# Altium schematic sheet TOP.SchDoc
size A3; DrawnBy: Lorna Lan, Dylan Vogel; DocumentNumber: 1; Revision: v4.3; SheetNumber: 1; SheetTotal: 20
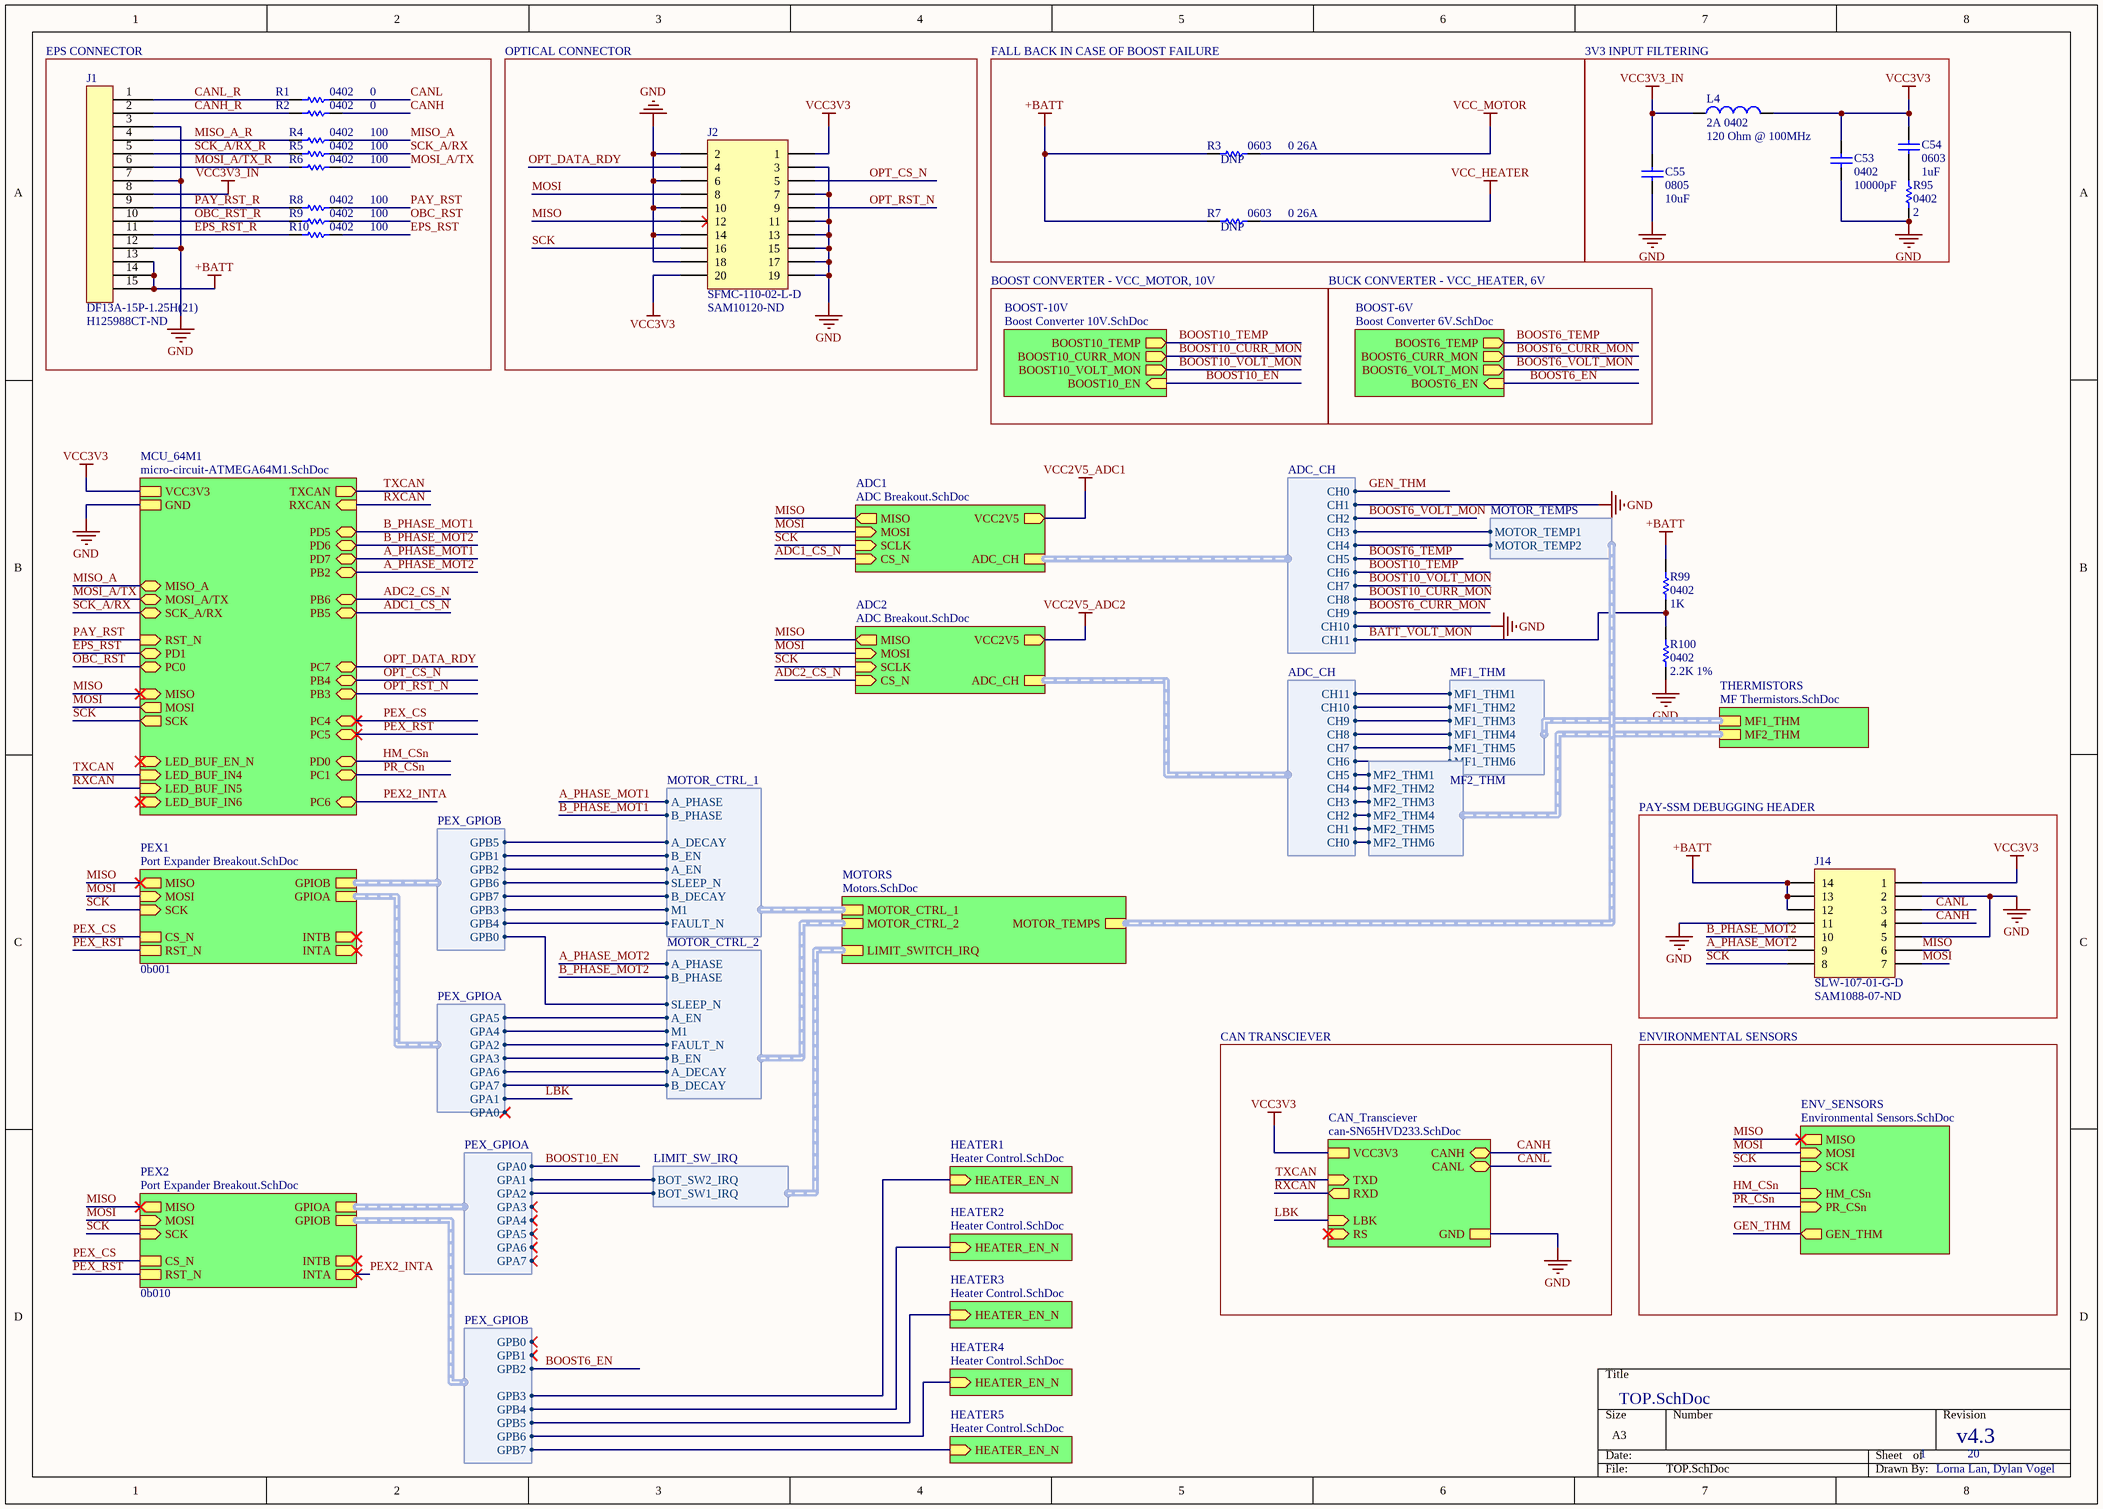
[diagram p0: TOP.SchDoc]

## Parts
C53  0402  value 10000pF  [CAP0402R]
C54  0603  value 1uF  [CAP0603R]
C55  0805  value 10uF  [CAP0805R]
J1  DF13A-15P-1.25H(21)  Supplier Part Number 1: H125988CT-ND  [DF13A-15P-1.25H(21)]
J2  SFMC-110-02-L-D  Supplier Part Number 1: SAM10120-ND  [TFM-110-02-L-D]
J14  SLW-107-01-G-D  Supplier Part Number 1: SAM1088-07-ND  [SLW-107-01-X-D]
L4  2A 0402  value 120 Ohm @ 100MHz  [RES0402R]
R1  0402  value 0  [RES0402R]
R2  0402  value 0  [RES0402R]
R3  0603  value 0 26A  [RES0603R]
R4  0402  value 100  [RES0402R]
R5  0402  value 100  [RES0402R]
R6  0402  value 100  [RES0402R]
R7  0603  value 0 26A  [RES0603R]
R8  0402  value 100  [RES0402R]
R9  0402  value 100  [RES0402R]
R10  0402  value 100  [RES0402R]
R95  0402  value 2  [RES0402R]
R99  0402  value 1K  [RES0402R]
R100  0402  value 2.2K 1%  [RES0402R]

## Blocks framed on the sheet
EPS CONNECTOR: J1 R1 R2 R4-R6 R8-R10
OPTICAL CONNECTOR: J2
3V3 INPUT FILTERING: C53-C55 L4 R95
PAY-SSM DEBUGGING HEADER: J14

## Sub-sheets
ADC1 = ADC Breakout.SchDoc: MISO (out), ADC_CH (harness ADC_CH), SCLK (in), MOSI (in), CS_N (in), VCC2V5 (out)
ADC2 = ADC Breakout.SchDoc: MISO (out), ADC_CH (harness ADC_CH), SCLK (in), MOSI (in), CS_N (in), VCC2V5 (out)
BOOST-6V = Boost Converter 6V.SchDoc: BOOST6_TEMP (out), BOOST6_CURR_MON (out), BOOST6_VOLT_MON (out), BOOST6_EN (in)
BOOST-10V = Boost Converter 10V.SchDoc: BOOST10_CURR_MON (out), BOOST10_VOLT_MON (out), BOOST10_EN (in), BOOST10_TEMP (out)
CAN_Transciever = can-SN65HVD233.SchDoc: RS (in), GND, CANH (bidir), CANL (bidir), LBK (in), TXD (in), RXD (out), VCC3V3
ENV_SENSORS = Environmental Sensors.SchDoc: SCK (in), MOSI (in), MISO (out), PR_CSn (in), HM_CSn (in), GEN_THM (out)
HEATER1 = Heater Control.SchDoc: HEATER_EN_N (in)
HEATER2 = Heater Control.SchDoc: HEATER_EN_N (in)
HEATER3 = Heater Control.SchDoc: HEATER_EN_N (in)
HEATER4 = Heater Control.SchDoc: HEATER_EN_N (in)
HEATER5 = Heater Control.SchDoc: HEATER_EN_N (in)
MCU_64M1 = micro-circuit-ATMEGA64M1.SchDoc: GND, PD6 (bidir), PD1 (bidir), PC7 (bidir), PC4 (bidir), PB5 (bidir), PB2 (bidir), PB3 (bidir), PB4 (bidir), PC0 (bidir), TXCAN (out), RXCAN (in), SCK (out), MOSI (out), LED_BUF_IN6 (in), MOSI_A/TX (bidir), LED_BUF_IN4 (in), LED_BUF_IN5 (in), SCK_A/RX (bidir), MISO (in), MISO_A (bidir), RST_N (in), LED_BUF_EN_N (in), VCC3V3, PD7 (bidir), PC6 (bidir), PD5 (bidir), PC5 (bidir), PB6 (bidir), PD0 (bidir), PC1 (bidir)
MOTORS = Motors.SchDoc: MOTOR_CTRL_1 (harness MOTOR_CTRL_1), MOTOR_CTRL_2 (harness MOTOR_CTRL_2), MOTOR_TEMPS (harness MOTOR_TEMPS), LIMIT_SWITCH_IRQ (harness LIMIT_SW_IRQ)
PEX1 = Port Expander Breakout.SchDoc: INTB (out), INTA (out), GPIOA (harness PEX_GPIOA), MISO (out), MOSI (in), GPIOB (harness PEX_GPIOB), SCK (in), RST_N, CS_N  | ADDRESS: 0b001
PEX2 = Port Expander Breakout.SchDoc: INTB (out), INTA (out), GPIOA (harness PEX_GPIOA), MISO (out), MOSI (in), GPIOB (harness PEX_GPIOB), SCK (in), RST_N, CS_N  | ADDRESS: 0b010
THERMISTORS = MF Thermistors.SchDoc: MF1_THM (harness MF1_THM), MF2_THM (harness MF2_THM)

## Harnesses
MOTOR_CTRL_1: SLEEP_N, A_EN, A_PHASE, B_PHASE, FAULT_N, M1, A_DECAY, B_DECAY, B_EN
PEX_GPIOA: GPA0, GPA1, GPA2, GPA3, GPA4, GPA5, GPA6, GPA7
PEX_GPIOB: GPB1, GPB6, GPB5, GPB4, GPB3, GPB0, GPB2, GPB7
MOTOR_CTRL_2: SLEEP_N, A_EN, B_EN, A_PHASE, B_PHASE, FAULT_N, M1, A_DECAY, B_DECAY
ADC_CH: CH0, CH1, CH2, CH3, CH4, CH5, CH6, CH7, CH8, CH9, CH10, CH11
PEX_GPIOB: GPB0, GPB1, GPB2, GPB3, GPB4, GPB5, GPB6, GPB7
MOTOR_TEMPS: MOTOR_TEMP1, MOTOR_TEMP2
MF1_THM: MF1_THM1, MF1_THM2, MF1_THM3, MF1_THM4, MF1_THM5, MF1_THM6
MF2_THM: MF2_THM1, MF2_THM2, MF2_THM3, MF2_THM4, MF2_THM5, MF2_THM6
LIMIT_SW_IRQ: BOT_SW1_IRQ, BOT_SW2_IRQ

## Nets
+BATT: J1.13 J1.14 J1.15 J14.2(14) J14.4(13) J14.6(12) R3.1 R7.1 R99.2
GND: C53.1 C55.1 J1.3 J1.7 J1.12 J2.2 J2.3 J2.6 J2.7 J2.10 J2.11 J2.13 J2.14 J2.15 J2.17 J2.18 J2.19 J14.3(2) J14.8(11) J14.9(5) R95.1 R100.1 ; sheet CAN_Transciever/GND, sheet MCU_64M1/GND, sheet ADC1/ADC_CH.CH1, sheet ADC1/ADC_CH.CH10
VCC2V5_ADC1: sheet ADC1/VCC2V5
VCC2V5_ADC2: sheet ADC2/VCC2V5
VCC3V3: C53.2 C54.2 J2.1 J2.20 J14.1 L4.2 ; sheet CAN_Transciever/VCC3V3, sheet MCU_64M1/VCC3V3
VCC3V3_IN: C55.2 J1.8 L4.1
VCC_HEATER: R7.2
VCC_MOTOR: R3.2
A_PHASE_MOT1: sheet MCU_64M1/PD7, sheet MOTORS/MOTOR_CTRL_1.A_PHASE
A_PHASE_MOT2: J14.12(9) ; sheet MCU_64M1/PB2, sheet MOTORS/MOTOR_CTRL_2.A_PHASE
ADC1_CS_N: sheet MCU_64M1/PB5, sheet ADC1/CS_N
ADC2_CS_N: sheet MCU_64M1/PB6, sheet ADC2/CS_N
B_PHASE_MOT1: sheet MCU_64M1/PD5, sheet MOTORS/MOTOR_CTRL_1.B_PHASE
B_PHASE_MOT2: J14.10 ; sheet MCU_64M1/PD6, sheet MOTORS/MOTOR_CTRL_2.B_PHASE
BATT_VOLT_MON: R99.1 R100.2 ; sheet ADC1/ADC_CH.CH11
BOOST6_CURR_MON: sheet BOOST-6V/BOOST6_CURR_MON, sheet ADC1/ADC_CH.CH9
BOOST6_EN: sheet BOOST-6V/BOOST6_EN, sheet PEX2/GPIOB.GPB2
BOOST6_TEMP: sheet BOOST-6V/BOOST6_TEMP, sheet ADC1/ADC_CH.CH5
BOOST6_VOLT_MON: sheet BOOST-6V/BOOST6_VOLT_MON, sheet ADC1/ADC_CH.CH2
BOOST10_CURR_MON: sheet BOOST-10V/BOOST10_CURR_MON, sheet ADC1/ADC_CH.CH8
BOOST10_EN: sheet BOOST-10V/BOOST10_EN, sheet PEX2/GPIOA.GPA0
BOOST10_TEMP: sheet BOOST-10V/BOOST10_TEMP, sheet ADC1/ADC_CH.CH6
BOOST10_VOLT_MON: sheet BOOST-10V/BOOST10_VOLT_MON, sheet ADC1/ADC_CH.CH7
CANH: J14.7(4) R2.2 ; sheet CAN_Transciever/CANH
CANH_R: J1.2 R2.1
CANL: J14.5(3) R1.2 ; sheet CAN_Transciever/CANL
CANL_R: J1.1 R1.1
EPS_RST: R10.2 ; sheet MCU_64M1/PD1
EPS_RST_R: J1.11 R10.1
GEN_THM: sheet ENV_SENSORS/GEN_THM, sheet ADC1/ADC_CH.CH0
HM_CSn: sheet ENV_SENSORS/HM_CSn, sheet MCU_64M1/PD0
LBK: sheet CAN_Transciever/LBK, sheet PEX1/GPIOA.GPA1
MISO: J2.12 J14.11(6) ; sheet ENV_SENSORS/MISO, sheet MCU_64M1/MISO, sheet PEX1/MISO, sheet PEX2/MISO, sheet ADC1/MISO, sheet ADC2/MISO
MISO_A: R4.2 ; sheet MCU_64M1/MISO_A
MISO_A_R: J1.4 R4.1
MOSI: J2.8 J14.13(7) ; sheet ENV_SENSORS/MOSI, sheet MCU_64M1/MOSI, sheet PEX1/MOSI, sheet PEX2/MOSI, sheet ADC1/MOSI, sheet ADC2/MOSI
MOSI_A/TX: R6.2 ; sheet MCU_64M1/MOSI_A/TX
MOSI_A/TX_R: J1.6 R6.1
OBC_RST: R9.2 ; sheet MCU_64M1/PC0
OBC_RST_R: J1.10 R9.1
OPT_CS_N: J2.5 ; sheet MCU_64M1/PB4
OPT_DATA_RDY: J2.4 ; sheet MCU_64M1/PC7
OPT_RST_N: J2.9 ; sheet MCU_64M1/PB3
PAY_RST: R8.2 ; sheet MCU_64M1/RST_N
PAY_RST_R: J1.9 R8.1
PEX2_INTA: sheet MCU_64M1/PC6, sheet PEX2/INTA
PEX_CS: sheet MCU_64M1/PC4, sheet PEX1/CS_N, sheet PEX2/CS_N
PEX_RST: sheet MCU_64M1/PC5, sheet PEX1/RST_N, sheet PEX2/RST_N
PR_CSn: sheet ENV_SENSORS/PR_CSn, sheet MCU_64M1/PC1
RXCAN: sheet CAN_Transciever/RXD, sheet MCU_64M1/RXCAN, sheet MCU_64M1/LED_BUF_IN5
SCK: J2.16 J14.14(8) ; sheet ENV_SENSORS/SCK, sheet MCU_64M1/SCK, sheet PEX1/SCK, sheet PEX2/SCK, sheet ADC1/SCLK, sheet ADC2/SCLK
SCK_A/RX: R5.2 ; sheet MCU_64M1/SCK_A/RX
SCK_A/RX_R: J1.5 R5.1
TXCAN: sheet CAN_Transciever/TXD, sheet MCU_64M1/TXCAN, sheet MCU_64M1/LED_BUF_IN4
NetC54_1: C54.1 R95.2
(unnamed): sheet HEATER1/HEATER_EN_N, sheet PEX2/GPIOB.GPB3
(unnamed): sheet HEATER2/HEATER_EN_N, sheet PEX2/GPIOB.GPB4
(unnamed): sheet HEATER3/HEATER_EN_N, sheet PEX2/GPIOB.GPB5
(unnamed): sheet HEATER4/HEATER_EN_N, sheet PEX2/GPIOB.GPB6
(unnamed): sheet HEATER5/HEATER_EN_N, sheet PEX2/GPIOB.GPB7
(unnamed): sheet MOTORS/MOTOR_CTRL_1.SLEEP_N, sheet PEX1/GPIOB.GPB6
(unnamed): sheet MOTORS/MOTOR_CTRL_1.A_EN, sheet PEX1/GPIOB.GPB2
(unnamed): sheet MOTORS/MOTOR_CTRL_1.FAULT_N, sheet PEX1/GPIOB.GPB4
(unnamed): sheet MOTORS/MOTOR_CTRL_1.M1, sheet PEX1/GPIOB.GPB3
(unnamed): sheet MOTORS/MOTOR_CTRL_1.A_DECAY, sheet PEX1/GPIOB.GPB5
(unnamed): sheet MOTORS/MOTOR_CTRL_1.B_DECAY, sheet PEX1/GPIOB.GPB7
(unnamed): sheet MOTORS/MOTOR_CTRL_1.B_EN, sheet PEX1/GPIOB.GPB1
(unnamed): sheet PEX2/GPIOA.GPA1, sheet MOTORS/LIMIT_SWITCH_IRQ.BOT_SW2_IRQ
(unnamed): sheet PEX2/GPIOA.GPA2, sheet MOTORS/LIMIT_SWITCH_IRQ.BOT_SW1_IRQ
(unnamed): sheet MOTORS/MOTOR_CTRL_2.SLEEP_N, sheet PEX1/GPIOB.GPB0
(unnamed): sheet MOTORS/MOTOR_CTRL_2.A_EN, sheet PEX1/GPIOA.GPA5
(unnamed): sheet MOTORS/MOTOR_CTRL_2.B_EN, sheet PEX1/GPIOA.GPA3
(unnamed): sheet MOTORS/MOTOR_CTRL_2.FAULT_N, sheet PEX1/GPIOA.GPA2
(unnamed): sheet MOTORS/MOTOR_CTRL_2.M1, sheet PEX1/GPIOA.GPA4
(unnamed): sheet MOTORS/MOTOR_CTRL_2.A_DECAY, sheet PEX1/GPIOA.GPA6
(unnamed): sheet MOTORS/MOTOR_CTRL_2.B_DECAY, sheet PEX1/GPIOA.GPA7
(unnamed): sheet ADC1/ADC_CH.CH3, sheet MOTORS/MOTOR_TEMPS.MOTOR_TEMP1
(unnamed): sheet ADC1/ADC_CH.CH4, sheet MOTORS/MOTOR_TEMPS.MOTOR_TEMP2
(unnamed): sheet ADC2/ADC_CH.CH0, sheet THERMISTORS/MF2_THM.MF2_THM6
(unnamed): sheet ADC2/ADC_CH.CH1, sheet THERMISTORS/MF2_THM.MF2_THM5
(unnamed): sheet ADC2/ADC_CH.CH2, sheet THERMISTORS/MF2_THM.MF2_THM4
(unnamed): sheet ADC2/ADC_CH.CH3, sheet THERMISTORS/MF2_THM.MF2_THM3
(unnamed): sheet ADC2/ADC_CH.CH4, sheet THERMISTORS/MF2_THM.MF2_THM2
(unnamed): sheet ADC2/ADC_CH.CH5, sheet THERMISTORS/MF2_THM.MF2_THM1
(unnamed): sheet ADC2/ADC_CH.CH6, sheet THERMISTORS/MF1_THM.MF1_THM6
(unnamed): sheet ADC2/ADC_CH.CH7, sheet THERMISTORS/MF1_THM.MF1_THM5
(unnamed): sheet ADC2/ADC_CH.CH8, sheet THERMISTORS/MF1_THM.MF1_THM4
(unnamed): sheet ADC2/ADC_CH.CH9, sheet THERMISTORS/MF1_THM.MF1_THM3
(unnamed): sheet ADC2/ADC_CH.CH10, sheet THERMISTORS/MF1_THM.MF1_THM2
(unnamed): sheet ADC2/ADC_CH.CH11, sheet THERMISTORS/MF1_THM.MF1_THM1

## Notes on the sheet
- FALL BACK IN CASE OF BOOST FAILURE
- (near R3) DNP
- (near R7) DNP
- BOOST CONVERTER - VCC_MOTOR, 10V
- BUCK CONVERTER - VCC_HEATER, 6V
- CAN TRANSCIEVER
- ENVIRONMENTAL SENSORS

## Library data of the parts
C53 = Cap: Capacitor; Published: 8-Jun-2000; LatestRevisionDate: 17-Jul-2002; LatestRevisionNote: Re-released for DXP Platform.; PackageReference: RAD-0.3; Publisher: Altium Limited; PackageDescription: Radial Cap, Thru-Hole; 2 Leads; 0.3 in Pin Spacing
C54 = CAP0603: 0603 capacitor; Manufacturer: KEMET; Manufacturer Part Number: C0603C105K4RACAUTO; Tolerance: 10%; Voltage Rating: 16V; Supplier 1: Digi-Key; Supplier Part Number 1: 399-17704-1-ND; Stock 1: 376276; Pricing 1: 1=0.17, 10=0.12, 100=0.0564, 500=0.03952, 1000=0.03273 (USD); Mount: Surface Mount; Case/Package: 0603; Case Code (Imperial): 0603; Case Code (Metric): 1608; Min Operating Temperature: -55°C; Max Operating Temperature: 125°C; Packaging: Cut Tape; Capacitance: 1uF; Ratings: AEC-Q200; Supplier 2: Digi-Key; Supplier Part Number 2: 587-3467-1-ND
C55 = CAP0805: 0805 capacitor; Manufacturer: Murata; Manufacturer Part Number: GCM21BR70J106KE22K; Tolerance: 10%; Dielectric: X7R; Voltage Rating (DC): 6.3V; Supplier 1: Digi-Key; Supplier Part Number 1: 490-14361-1-ND; Stock 1: 214938; Pricing 1: 1=0.42, 10=0.29, 100=0.1742, 500=0.13064, 1000=0.11031, 2500=0.10451, 5000=0.0987 (USD); Case/Package: 0805; Min Operating Temperature: -55°C; Max Operating Temperature: 125°C; Capacitance: 10uF; Packaging: Tape and Reel; Length: 2mm; Depth: 1.25mm; Lead Free: Lead Free
J1 = DF13A-15P-1.25H(21): 15 pos DF13 right angle surface mount connector; Supplier 1: Digi-Key
J2 = SFMC-110-02-L-D: 20 pos 50mil pitch low profile SMD connector; Supplier 1: Digi-Key
J14 = SLW-107-01-G-D: 14 pos 100 mil pitch low profile header; Supplier 1: Digi-Key
L4 = Inductor: Manufacturer: Murata; Manufacturer Part Number: BLM15PX121SZ1D; Code_IEC: 1005; Number of Lines: 1; DC Resistance (DCR): 55mR; Published: 8-Jun-2000; LatestRevisionDate: 29-May-2009; LatestRevisionNote: IPC-7351 Footprint Added.; PackageReference: 0402-A; Publisher: Altium Limited; PackageDescription: Chip Inductor; Code_JEITA: 0402; Supplier 1: Digi-Key; Supplier Part Number 1: 490-16505-1-ND; Stock 1: 18936; Pricing 1: 1=0.15, 10=0.125, 25=0.0972, 50=0.0804, 100=0.0693, 250=0.05544, 500=0.0499, 1000=0.04158, 5000=0.03881 (USD); Mount: Surface Mount; Case/Package: 0402; Case Code (Imperial): 0402; Case Code (Metric): 1005; Min Operating Temperature: -55°C; Max Operating Temperature: 125°C; Packaging: Cut Tape; Max Current Rating: 2A; Ratings: AEC-Q200
R1 R2 = RES0402: 0402 resistor; Manufacturer: Panasonic; Manufacturer Part Number: ERJ-2GE0R00X; Resistance: 0mR; Power Rating: 100mW; Voltage Rating: 50V; Tolerance: 5%; Temperature Coefficient: 600ppm/°C; Supplier 1: Digi-Key; Supplier Part Number 1: P0.0JCT-ND; Stock 1: 47740000; Pricing 1: 1=0.1, 10=0.03, 25=0.0216, 50=0.0164, 100=0.0121, 250=0.00924, 500=0.0074, 1000=0.00545, 5000=0.00391 (USD); Mount: Surface Mount; Case/Package: 0402; Case Code (Metric): 1005; Case Code (Imperial): 0402; Contact Plating: Tin; Min Operating Temperature: -55°C; Max Operating Temperature: 155°C; Packaging: Tape and Reel; Package Quantity: 1; Composition: Thick Film; Number of Terminations: 2; Termination: SMD/SMT; Military Standard: Not; Max Power Dissipation: 100mW; Voltage Rating (DC): 50V; Features: Automotive AEC-Q200; Length: 1mm; Height: 0.35mm; Width: 0.02inch; Depth: 0.5mm; Radiation Hardening: No; REACH SVHC: No SVHC; Lead Free: Lead Free; ComponentLink1URL: http://industrial.panasonic.com/www-data/pdf/AOA0000/AOA0000CE1.pdf?src-supplier=Avnet; ComponentLink1Description: http://industrial.panasonic.com/www-data/pdf/AOA0000/AOA0000CE1.pdf?src-supplier=Avnet; ComponentLink2URL: http://www.alliedelec.com/m/d/51cd0790071e1666bdb9d00c57fcf960.pdf?src-supplier=Allied+Electronics; ComponentLink2Description: http://www.alliedelec.com/m/d/51cd0790071e1666bdb9d00c57fcf960.pdf?src-supplier=Allied+Electronics; ComponentLink3URL: http://industrial.panasonic.com/www-data/pdf/AOA0000/AOA0000CE1.pdf?src-supplier=Avnet+Europe; ComponentLink3Description: http://industrial.panasonic.com/www-data/pdf/AOA0000/AOA0000CE1.pdf?src-supplier=Avnet+Europe; ComponentLink4URL: http://www.farnell.com/datasheets/2059623.pdf?src-supplier=Farnell; ComponentLink4Description: http://www.farnell.com/datasheets/2059623.pdf?src-supplier=Farnell; ComponentLink5URL: http://www.farnell.com/datasheets/2059623.pdf?src-supplier=Element14; ComponentLink5Description: http://www.farnell.com/datasheets/2059623.pdf?src-supplier=Element14; ComponentLink6URL: http://www.farnell.com/datasheets/1678796.pdf?src-supplier=Element14; ComponentLink6Description: http://www.farnell.com/datasheets/1678796.pdf?src-supplier=Element14
R3 R7 = RES0603: 0603 resistor; Supplier 1: Digi-Key; Supplier Part Number 1: 2019-TLRZ1JTTDCT-ND
R4-R6 R8-R10 R99 R100 = RES0402: 0402 resistor
  R99: Supplier 1: Digi-Key; Supplier Part Number 1: YAG1234CT-ND
R95 = Res1: Resistor; Published: 8-Jun-2000; LatestRevisionDate: 17-Jul-2002; LatestRevisionNote: Re-released for DXP Platform.; PackageReference: AXIAL-0.3; Publisher: Altium Limited; PackageDescription: Axial Device, Thru-Hole; 2 Leads; 0.3 in Pin Spacing; Supplier 1: Digi-Key; Supplier Part Number 1: YAG3472CT-ND